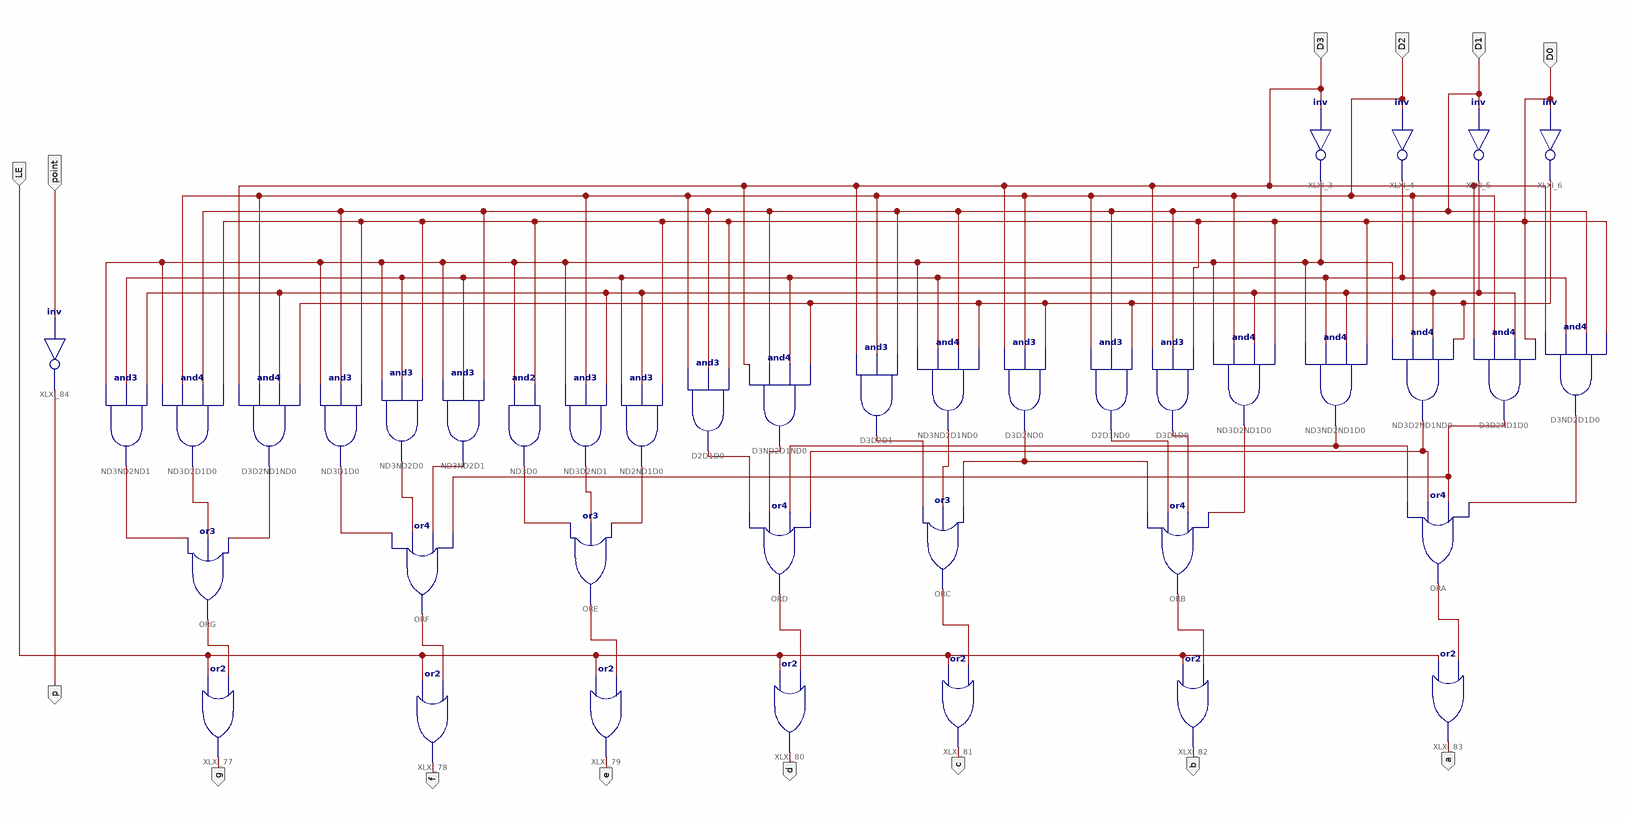
[diagram p0: schematic sheet 1]
// Xilinx ISE schematic MC14495_ZJU.sch (kintex7) as structural Verilog: 40 symbols, 14 ports
module MC14495_ZJU (
  input  D0,
  input  D1,
  input  D3,
  input  D2,
  input  LE,
  input  point,
  output p,
  output a,
  output b,
  output c,
  output d,
  output e,
  output f,
  output g
);

  wire ND0, ND1, ND2, ND3, XLXN_34, XLXN_36, XLXN_38, XLXN_39, XLXN_40, XLXN_41, XLXN_42, XLXN_50, XLXN_51,
       XLXN_95, XLXN_100, XLXN_132, XLXN_133, XLXN_134, XLXN_135, XLXN_136, XLXN_137, XLXN_138, XLXN_139,
       XLXN_140, XLXN_141, XLXN_143, XLXN_147, XLXN_148, XLXN_154, XLXN_155, XLXN_156, XLXN_157;

  not XLXI_5 (ND1, D1);
  not XLXI_6 (ND0, D0);
  not XLXI_3 (ND3, D3);
  and D3ND2D1D0 (XLXN_36, D3, ND2, D1, D0);
  not XLXI_4 (ND2, D2);
  and ND3D2ND1ND0 (XLXN_34, ND3, D2, ND1, ND0);
  and ND3ND2ND1D0 (XLXN_95, ND3, ND2, ND1, D0);
  and D3D2ND1D0 (XLXN_135, D3, D2, ND1, D0);
  and ND3D2ND1D0 (XLXN_41, ND3, D2, ND1, D0);
  and D3D1D0 (XLXN_40, D3, D1, D0);
  and D2D1ND0 (XLXN_39, D2, D1, ND0);
  or ORB (XLXN_156, XLXN_38, XLXN_39, XLXN_40, XLXN_41);
  or ORA (XLXN_157, XLXN_95, XLXN_34, XLXN_135, XLXN_36);
  and ND3ND2D1ND0 (XLXN_100, ND3, ND2, D1, ND0);
  and D3D2D1 (XLXN_42, D3, D2, D1);
  or ORC (XLXN_155, XLXN_42, XLXN_100, XLXN_38);
  and D3D2ND0 (XLXN_38, D3, D2, ND0);
  and D3ND2D1ND0 (XLXN_51, D3, D1, ND2, ND0);
  and D2D1D0 (XLXN_50, D2, D1, D0);
  or ORD (XLXN_154, XLXN_50, XLXN_51, XLXN_95, XLXN_34);
  and ND3D0 (XLXN_132, ND3, D0);
  and ND3D2ND1 (XLXN_133, ND3, D2, ND1);
  and ND2ND1D0 (XLXN_134, ND2, ND1, D0);
  or ORE (XLXN_148, XLXN_132, XLXN_133, XLXN_134);
  and ND3D1D0 (XLXN_138, ND3, D1, D0);
  and ND3ND2D0 (XLXN_137, ND3, ND2, D0);
  and ND3ND2D1 (XLXN_136, ND3, ND2, D1);
  or ORF (XLXN_147, XLXN_138, XLXN_137, XLXN_136, XLXN_135);
  and ND3ND2ND1 (XLXN_139, ND3, ND2, ND1);
  and D3D2ND1ND0 (XLXN_141, D3, D2, ND1, ND0);
  and ND3D2D1D0 (XLXN_140, ND3, D2, D1, D0);
  or ORG (XLXN_143, XLXN_139, XLXN_140, XLXN_141);
  or XLXI_77 (g, LE, XLXN_143);
  or XLXI_78 (f, LE, XLXN_147);
  or XLXI_79 (e, LE, XLXN_148);
  or XLXI_80 (d, LE, XLXN_154);
  or XLXI_81 (c, LE, XLXN_155);
  or XLXI_82 (b, LE, XLXN_156);
  or XLXI_83 (a, LE, XLXN_157);
  not XLXI_84 (p, point);
endmodule
